# EAGLE design Video_critter_hires_v01 (EAGLE 6.1)
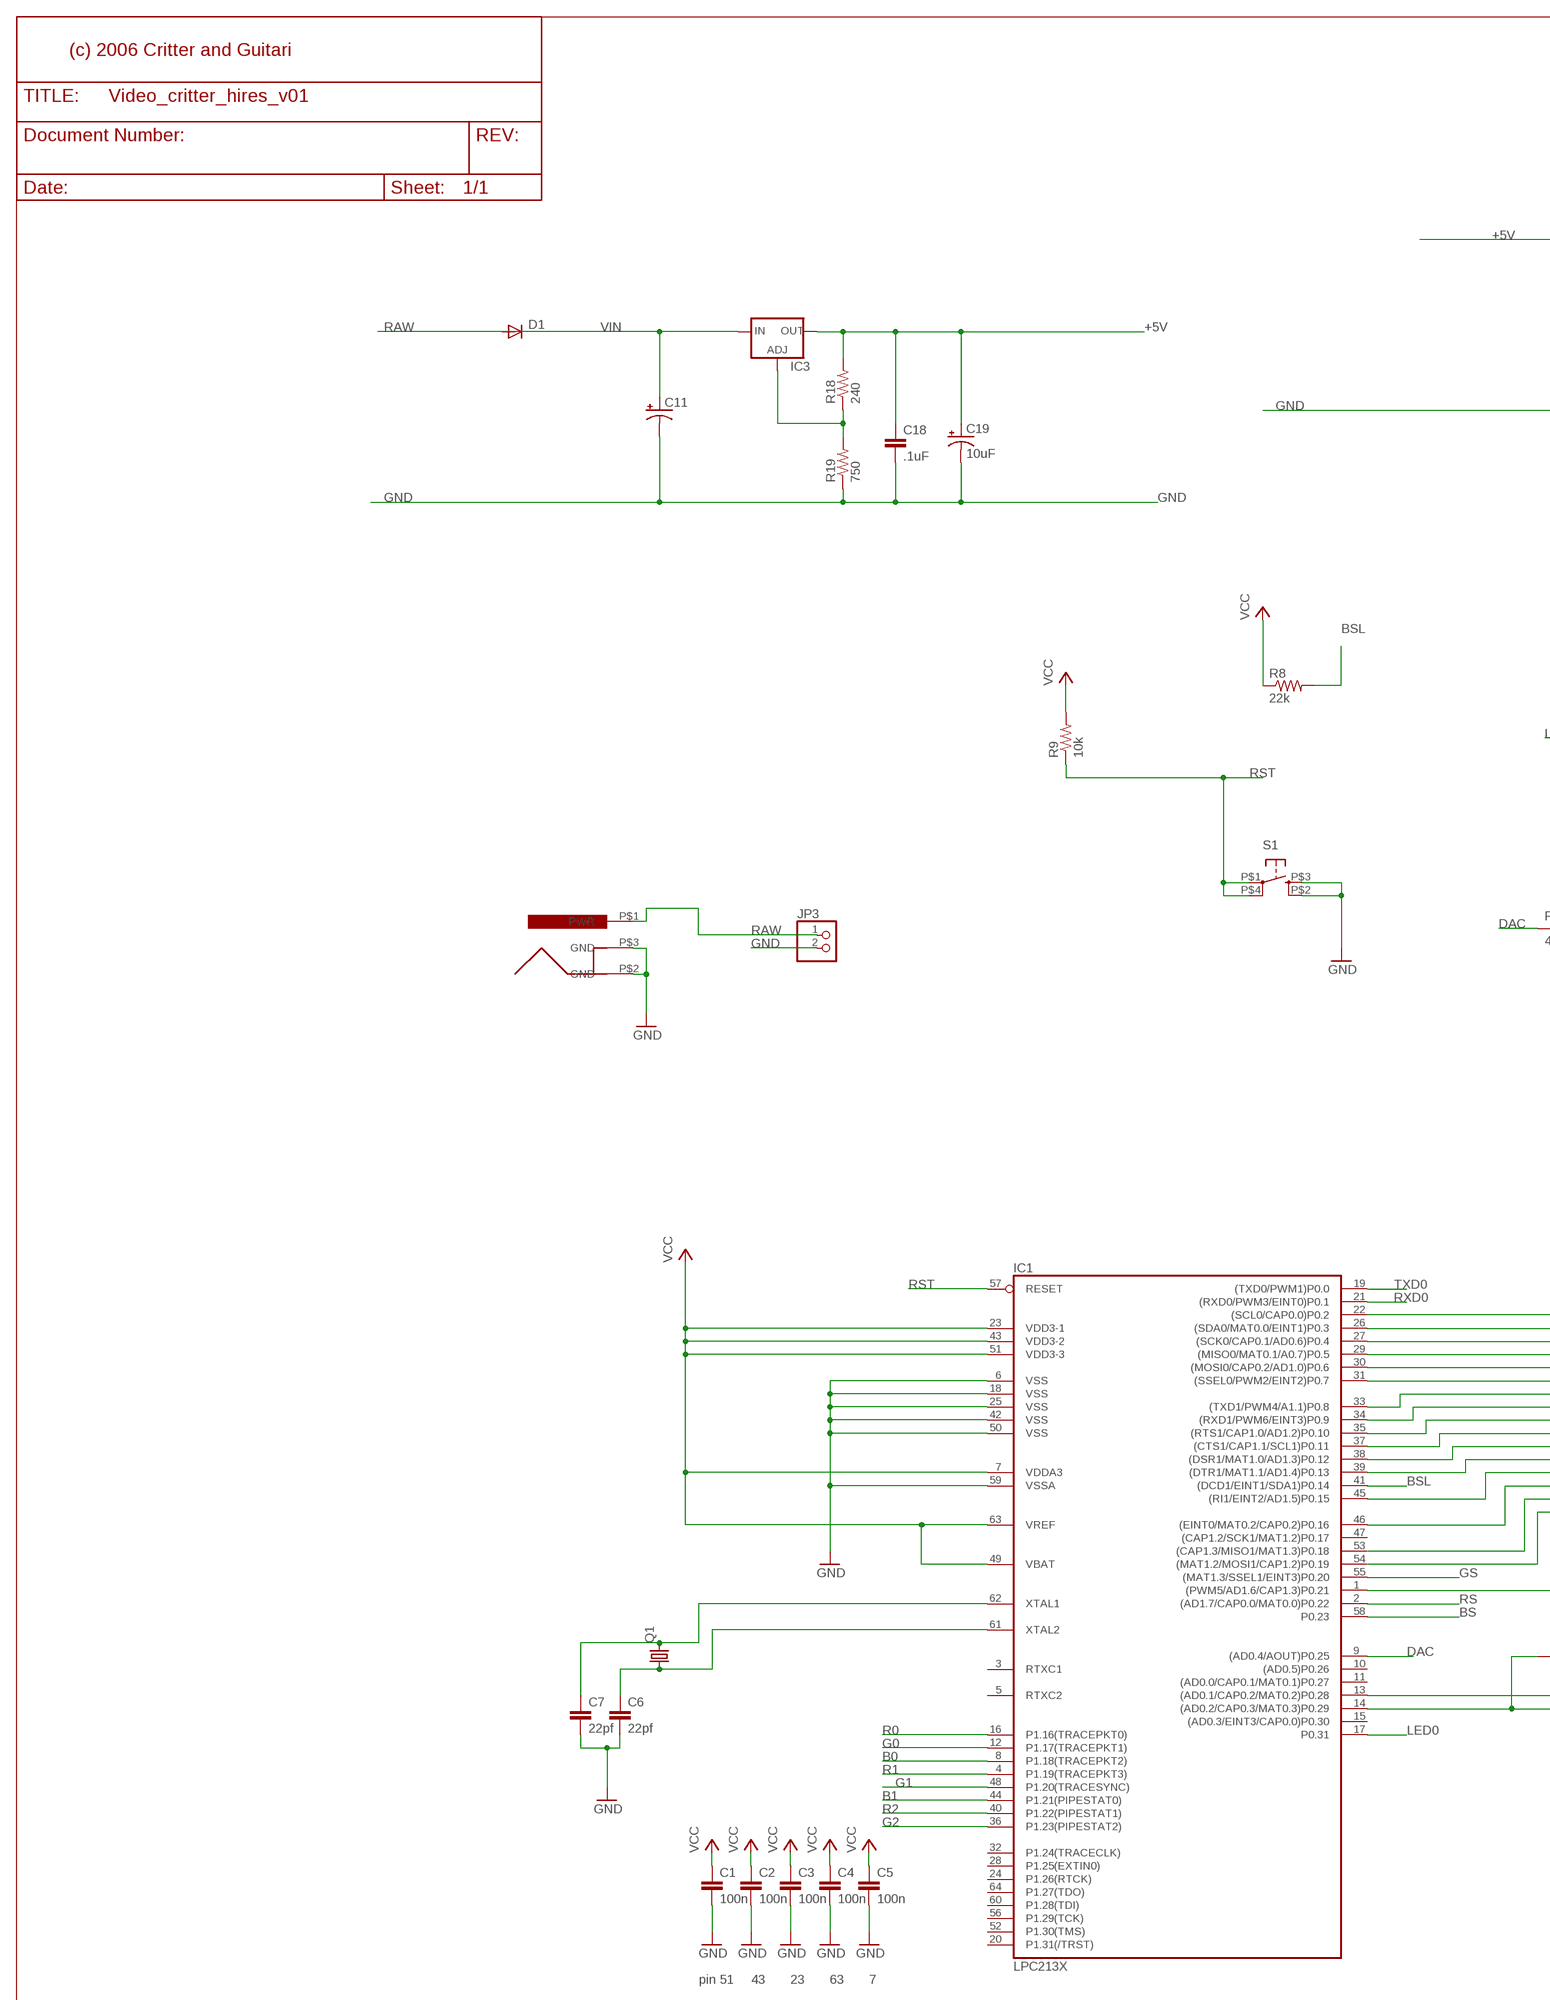
[diagram p0: schematic, sheet 1, part 1 of 2]
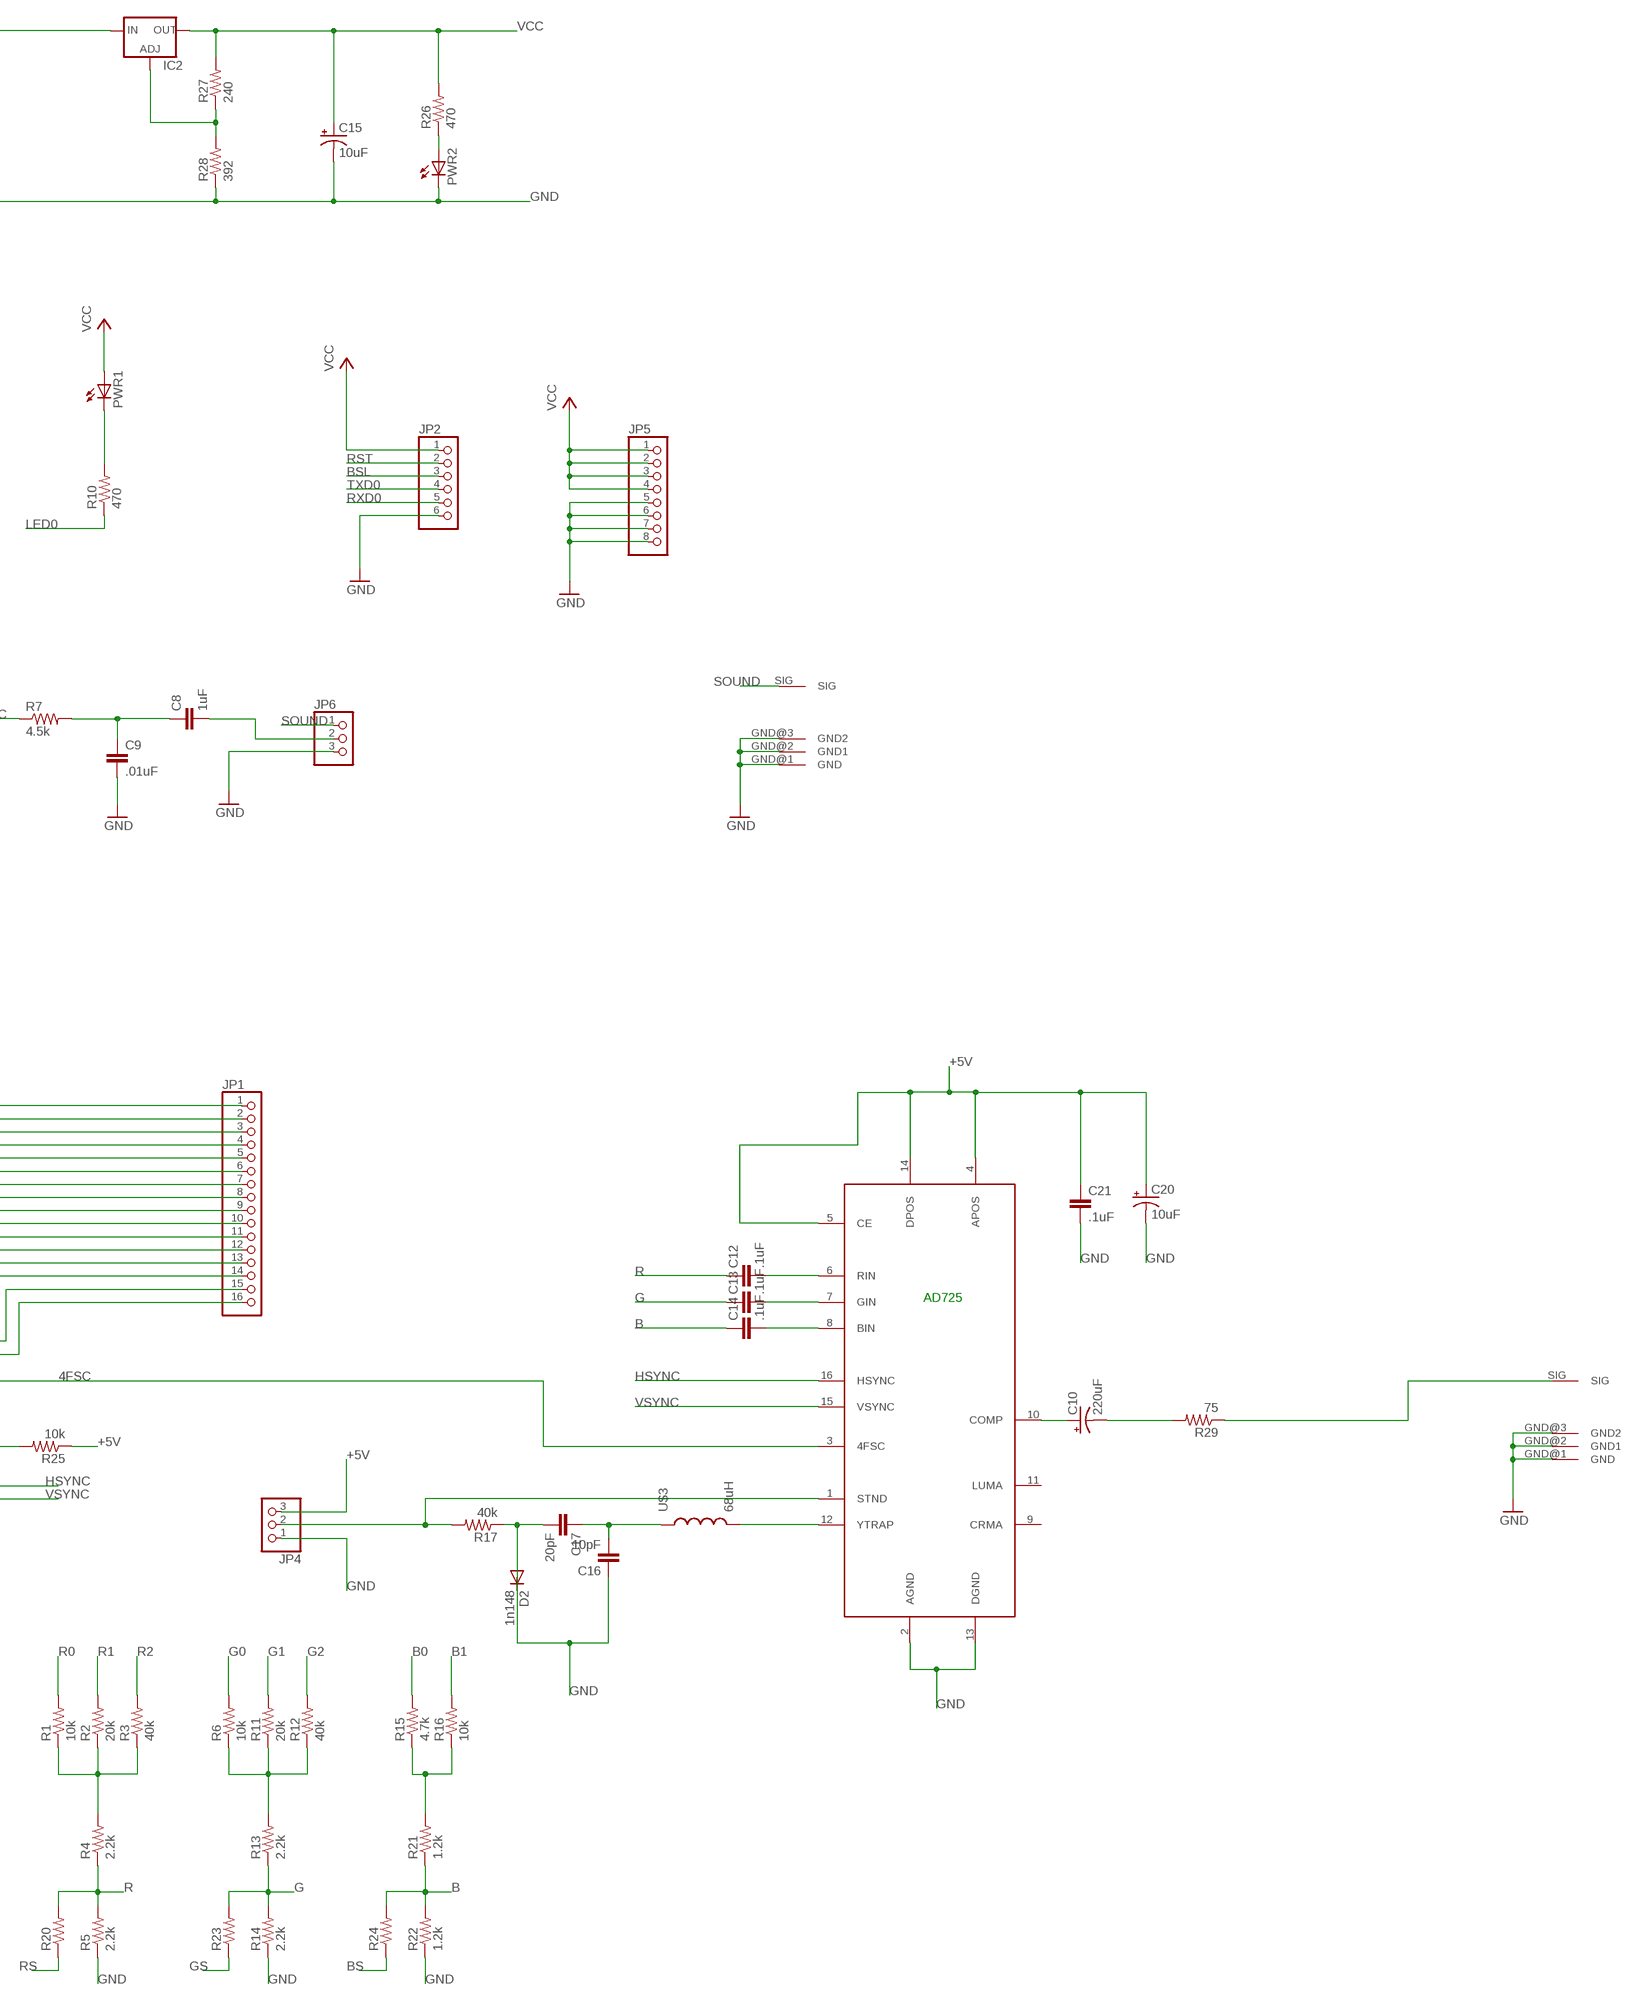
[diagram p1: schematic, sheet 1, part 2 of 2]

## Parts
C1  100n  CAP0603  [C0603]
C2  100n  CAP0603  [C0603]
C3  100n  CAP0603  [C0603]
C4  100n  CAP0603  [C0603]
C5  100n  CAP0603  [C0603]
C6  22pf  CAP0603  [C0603]
C7  22pf  CAP0603  [C0603]
C8  1uF  CAP0603  [C0603]
C9  .01uF  CAP0603  [C0603]
C10  220uF  CPOL-USD  [PANASONIC_D]
C11  CPOL-USE3.5-8  [E3,5-8]
C12  .1uF  CAP0603  [C0603]
C13  .1uF  CAP0603  [C0603]
C14  .1uF  CAP0603  [C0603]
C15  10uF  CAP_POL1206  [CPOL_1206]
C16  10pF  CAP0603  [C0603]
C17  20pF  CAP0603  [C0603]
C18  .1uF  CAP0603  [C0603]
C19  10uF  CAP_POL1206  [CPOL_1206]
C20  10uF  CAP_POL1206  [CPOL_1206]
C21  .1uF  CAP0603  [C0603]
D1  DIODESMB  [SMB]
D2  1n148  DIODE  [SOD323-W]
IC1  LPC213X  [SQFP-S-10X10-64]
IC2  V_REG_FAN1117SOT223  [SOT223]
IC3  V_REG_FAN1117SOT223  [SOT223]
JP1  PINHD-1X16  [1X16]
JP2  PINHD-1X6  [1X06]
JP3  PINHD-1X2  [1X02]
JP4  PINHD-1X3  [1X03]
JP5  PINHD-1X8  [1X08]
JP6  PINHD-1X3  [1X03]
PWR1  LED1206  [CHIPLED_1206]
PWR2  LED1206  [CHIPLED_1206]
Q1  CRYSTALSOCKETED  [HC49U-SOCKETED]
R1  10k  RES0603  [R0603]
R2  20k  RES0603  [R0603]
R3  40k  RES0603  [R0603]
R4  2.2k  RES0603  [R0603]
R5  2.2k  RES0603  [R0603]
R6  10k  RES0603  [R0603]
R7  4.5k  RES0603  [R0603]
R8  22k  RES0603  [R0603]
R9  10k  RES0603  [R0603]
R10  470  RES0603  [R0603]
R11  20k  RES0603  [R0603]
R12  40k  RES0603  [R0603]
R13  2.2k  RES0603  [R0603]
R14  2.2k  RES0603  [R0603]
R15  4.7k  RES0603  [R0603]
R16  10k  RES0603  [R0603]
R17  40k  RES0603  [R0603]
R18  240  RES0603  [R0603]
R19  750  RES0603  [R0603]
R20  RES0603  [R0603]
R21  1.2k  RES0603  [R0603]
R22  1.2k  RES0603  [R0603]
R23  RES0603  [R0603]
R24  RES0603  [R0603]
R25  10k  RES0603  [R0603]
R26  470  RES0603  [R0603]
R27  240  RES0603  [R0603]
R28  392  RES0603  [R0603]
R29  75  RES0603  [R0603]
S1  TAC_SWITCH  [TACTILE_SWITCH_SMD]
U$1  POWER_JACK  POWER_JACKTHRU-HOLE  [POWER_JACK]
U$2  AD725  [SO16L]
U$3  68uH  INDUCTORSMALL  [INDUCTOR_SMALL]
U$5  PHONO_PLUG  [PHONO_PCB]
U$7  PHONO_PLUG  [PHONO_PCB]

## Nets
4FSC: IC1.1((PWM5/AD1.6/CAP1.3)P0.21) U$2.3(4FSC)
+5V: C18.1 C19.A(+) C20.A(+) C21.1 IC2.3(IN) IC3.2(OUT) JP4.3 R18.2 R25.1 U$2.4(APOS) U$2.5(CE) U$2.14(DPOS)
B: C14.1 R21.1 R22.2 R24.2
B0: IC1.8(P1.18(TRACEPKT2)) R15.2
B1: IC1.44(P1.21(PIPESTAT0)) R16.2
BS: IC1.58(P0.23) R24.1
BSL: IC1.41((DCD1/EINT1/SDA1)P0.14) JP2.3 R8.2
BURST: IC1.31((SSEL0/PWM2/EINT2)P0.7) JP1.6
DAC: IC1.9((AD0.4/AOUT)P0.25) R7.1
G: C13.1 R13.1 R14.2 R23.2
G0: IC1.12(P1.17(TRACEPKT1)) R6.2
G1: IC1.48(P1.20(TRACESYNC)) R11.2
G2: IC1.36(P1.23(PIPESTAT2)) R12.2
GND [power]: C1.2 C2.2 C3.2 C4.2 C5.2 C6.2 C7.2 C9.2 C11.- C15.C(-) C16.1 C18.2 C19.C(-) C20.C(-) C21.2 D2.A IC1.6(VSS) IC1.18(VSS) IC1.25(VSS) IC1.42(VSS) IC1.50(VSS) IC1.59(VSSA) JP2.6 JP3.2 JP4.1 JP5.5 JP5.6 JP5.7 JP5.8 JP6.3 PWR2.C R5.1 R14.1 R19.1 R22.1 R28.1 S1.P$2(S1) S1.P$3(S) U$1.P$2(GND) U$1.P$3(GND) U$2.2(AGND) U$2.13(DGND) U$5.GND@1(GND) U$5.GND@2(GND1) U$5.GND@3(GND2) U$7.GND@1(GND) U$7.GND@2(GND1) U$7.GND@3(GND2)
GS: IC1.55((MAT1.3/SSEL1/EINT3)P0.20) R23.1
HSYNC: IC1.13((AD0.1/CAP0.2/MAT0.2)P0.28) U$2.16(HSYNC)
LED0: IC1.17(P0.31) R10.1
N$1: C8.1 C9.1 R7.2
N$2: C7.1 IC1.62(XTAL1) Q1.2
N$3: C6.1 IC1.61(XTAL2) Q1.1
N$4: PWR1.C R10.2
N$5: C10.+ U$2.10(COMP)
N$6: IC1.22((SCL0/CAP0.0)P0.2) JP1.1
N$7: C8.2 JP6.2
N$8: C12.2 U$2.6(RIN)
N$9: IC1.26((SDA0/MAT0.0/EINT1)P0.3) JP1.2
N$10: IC1.27((SCK0/CAP0.1/AD0.6)P0.4) JP1.3
N$11: IC3.1(ADJ) R18.1 R19.2
N$12: IC1.29((MISO0/MAT0.1/A0.7)P0.5) JP1.4
N$13: IC1.30((MOSI0/CAP0.2/AD1.0)P0.6) JP1.5
N$14: C13.2 U$2.7(GIN)
N$15: IC1.33((TXD1/PWM4/A1.1)P0.8) JP1.7
N$16: IC1.34((RXD1/PWM6/EINT3)P0.9) JP1.8
N$17: IC1.35((RTS1/CAP1.0/AD1.2)P0.10) JP1.9
N$18: IC1.37((CTS1/CAP1.1/SCL1)P0.11) JP1.10
N$19: IC1.38((DSR1/MAT1.0/AD1.3)P0.12) JP1.11
N$20: IC1.39((DTR1/MAT1.1/AD1.4)P0.13) JP1.12
N$21: IC1.45((RI1/EINT2/AD1.5)P0.15) JP1.13
N$22: IC1.46((EINT0/MAT0.2/CAP0.2)P0.16) JP1.14
N$23: IC1.53((CAP1.3/MISO1/MAT1.3)P0.18) JP1.15
N$24: U$2.12(YTRAP) U$3.P$2
N$25: IC1.54((MAT1.2/MOSI1/CAP1.2)P0.19) JP1.16
N$26: C14.2 U$2.8(BIN)
N$27: R1.1 R2.1 R3.1 R4.2
N$28: R29.1 U$7.SIG
N$29: R6.1 R11.1 R12.1 R13.2
N$30: PWR2.A R26.1
N$31: R15.1 R16.1 R21.2
N$32: IC2.1(ADJ) R27.1 R28.2
N$33: C16.2 C17.1 U$3.P$1
N$34: C17.2 D2.C R17.1
N$35: JP4.2 R17.2 U$2.1(STND)
N$36: C10.- R29.2
R: C12.1 R4.1 R5.2 R20.2
R0: IC1.16(P1.16(TRACEPKT0)) R1.2
R1: IC1.4(P1.19(TRACEPKT3)) R2.2
R2: IC1.40(P1.22(PIPESTAT1)) R3.2
RAW: D1.1(C) JP3.1 U$1.P$1(PWR)
RS: IC1.2((AD1.7/CAP0.0/MAT0.0)P0.22) R20.1
RST: IC1.57(RESET) JP2.2 R9.1 S1.P$1(P) S1.P$4(P1)
RXD0: IC1.21((RXD0/PWM3/EINT0)P0.1) JP2.5
SOUND: JP6.1 U$5.SIG
TXD0: IC1.19((TXD0/PWM1)P0.0) JP2.4
VCC [power]: C1.1 C2.1 C3.1 C4.1 C5.1 C15.A(+) IC1.7(VDDA3) IC1.23(VDD3-1) IC1.43(VDD3-2) IC1.49(VBAT) IC1.51(VDD3-3) IC1.63(VREF) IC2.2(OUT) JP2.1 JP5.1 JP5.2 JP5.3 JP5.4 PWR1.A R8.1 R9.2 R26.2 R27.2
VIN [power]: C11.+ D1.2(A) IC3.3(IN)
VSYNC: IC1.14((AD0.2/CAP0.3/MAT0.3)P0.29) R25.2 U$2.15(VSYNC)
Unconnected: IC1.3(RTXC1) IC1.5(RTXC2) IC1.10((AD0.5)P0.26) IC1.11((AD0.0/CAP0.1/MAT0.1)P0.27) IC1.15((AD0.3/EINT3/CAP0.0)P0.30) IC1.20(P1.31(/TRST)) IC1.24(P1.26(RTCK)) IC1.28(P1.25(EXTIN0)) IC1.32(P1.24(TRACECLK)) IC1.47((CAP1.2/SCK1/MAT1.2)P0.17) IC1.52(P1.30(TMS)) IC1.56(P1.29(TCK)) IC1.60(P1.28(TDI)) IC1.64(P1.27(TDO)) U$2.9(CRMA) U$2.11(LUMA)

## Notes on the sheet
- (c) 2006 Critter and Guitari
- AD725
- pin 51 | 43 | 23 | 63 | 7

## Library data of the parts
C1-C9 C12-C14 C16-C18 C21 = SparkFun:CAP: CAPACITOR
C10 C11 = rcl:CPOL-US: POLARIZED CAPACITOR, American symbol
C15 C19 C20 = SparkFun:CAP_POL
D1 D2 = SparkFun:DIODE
IC1 = SparkFun:LPC213X
IC2 IC3 = SparkFun:V_REG_FAN1117: VOLTAGE REGULATOR
JP1 = pinhead:PINHD-1X16: PIN HEADER
JP2 = pinhead:PINHD-1X6: PIN HEADER
JP3 = pinhead:PINHD-1X2: PIN HEADER
JP4 JP6 = pinhead:PINHD-1X3: PIN HEADER
JP5 = pinhead:PINHD-1X8: PIN HEADER
PWR1 PWR2 = SparkFun:LED
Q1 = SparkFun:CRYSTAL
R1-R29 = SparkFun:RES: RESISTOR
S1 = SparkFun:TAC_SWITCH: OMRON SWITCH
U$1 = SparkFun:POWER_JACK
U$2 = SparkFun:AD725
U$3 = SparkFun:INDUCTOR
U$5 U$7 = sfe_owen:PHONO_PLUG

## Net classes
0 default: width 0.254 mm
1 power: width 0.254 mm

## Board
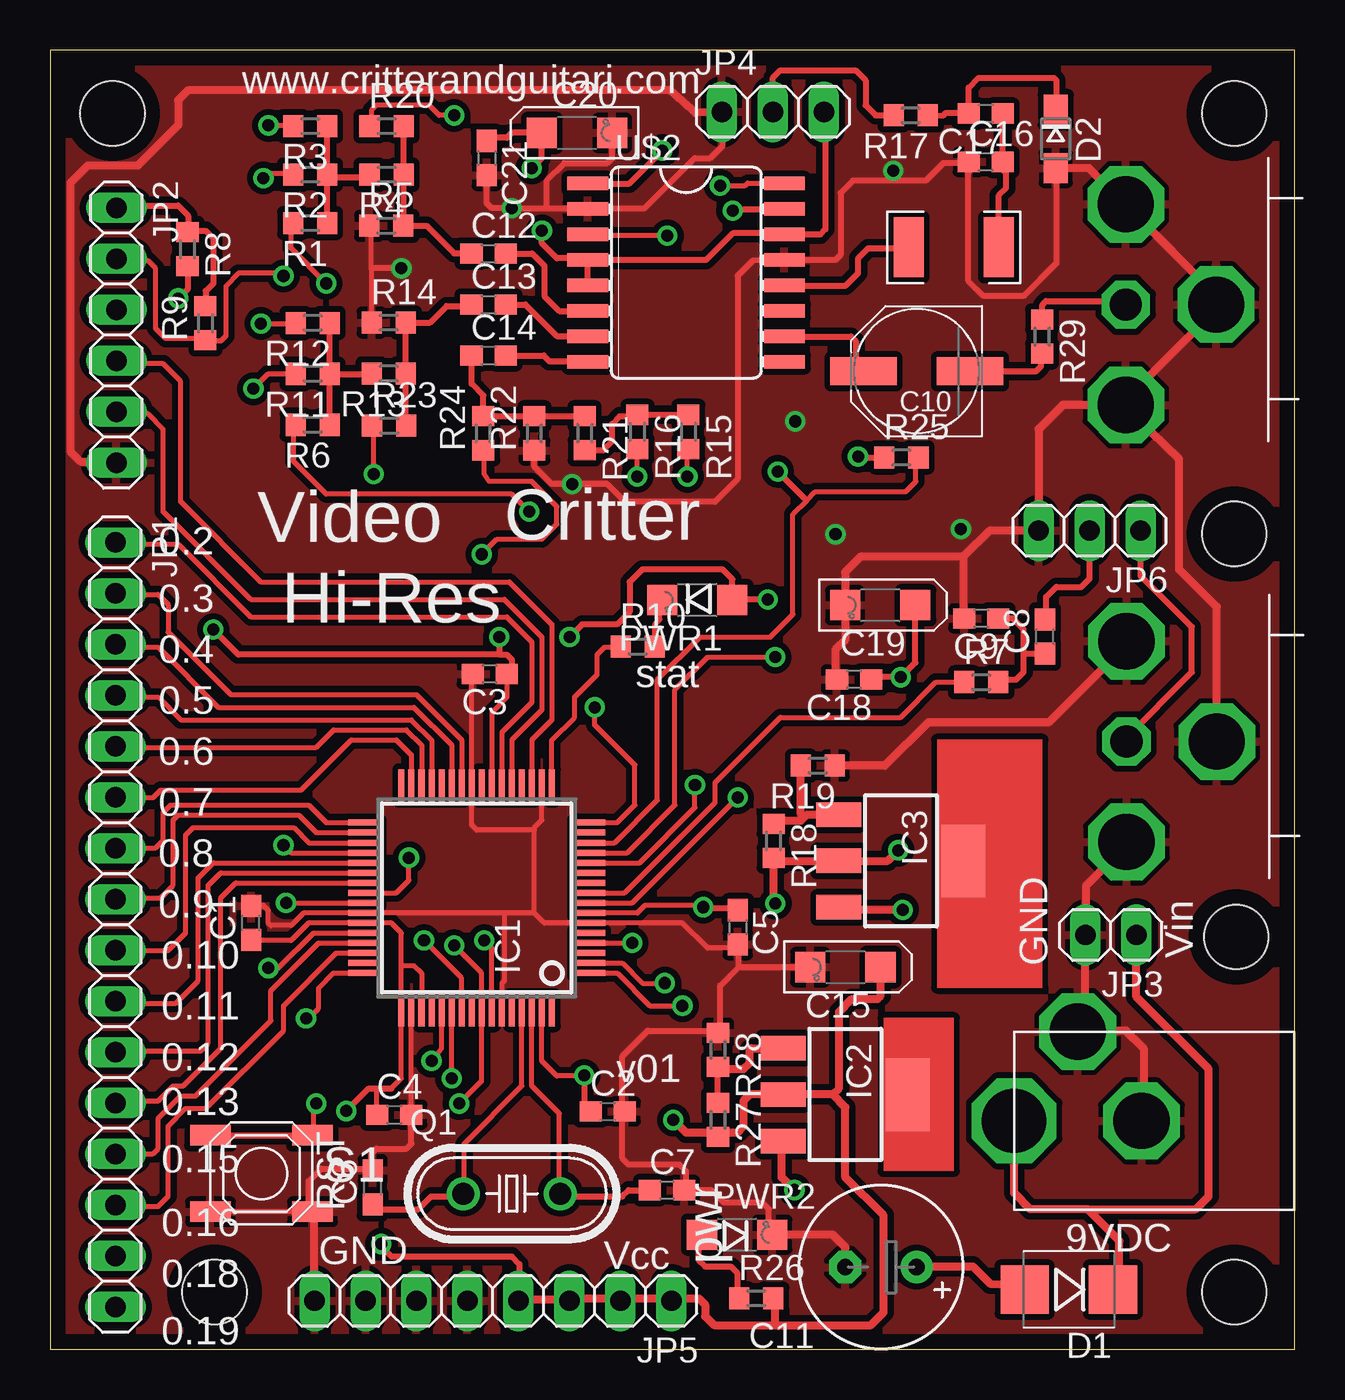
[diagram p2: board, top side]
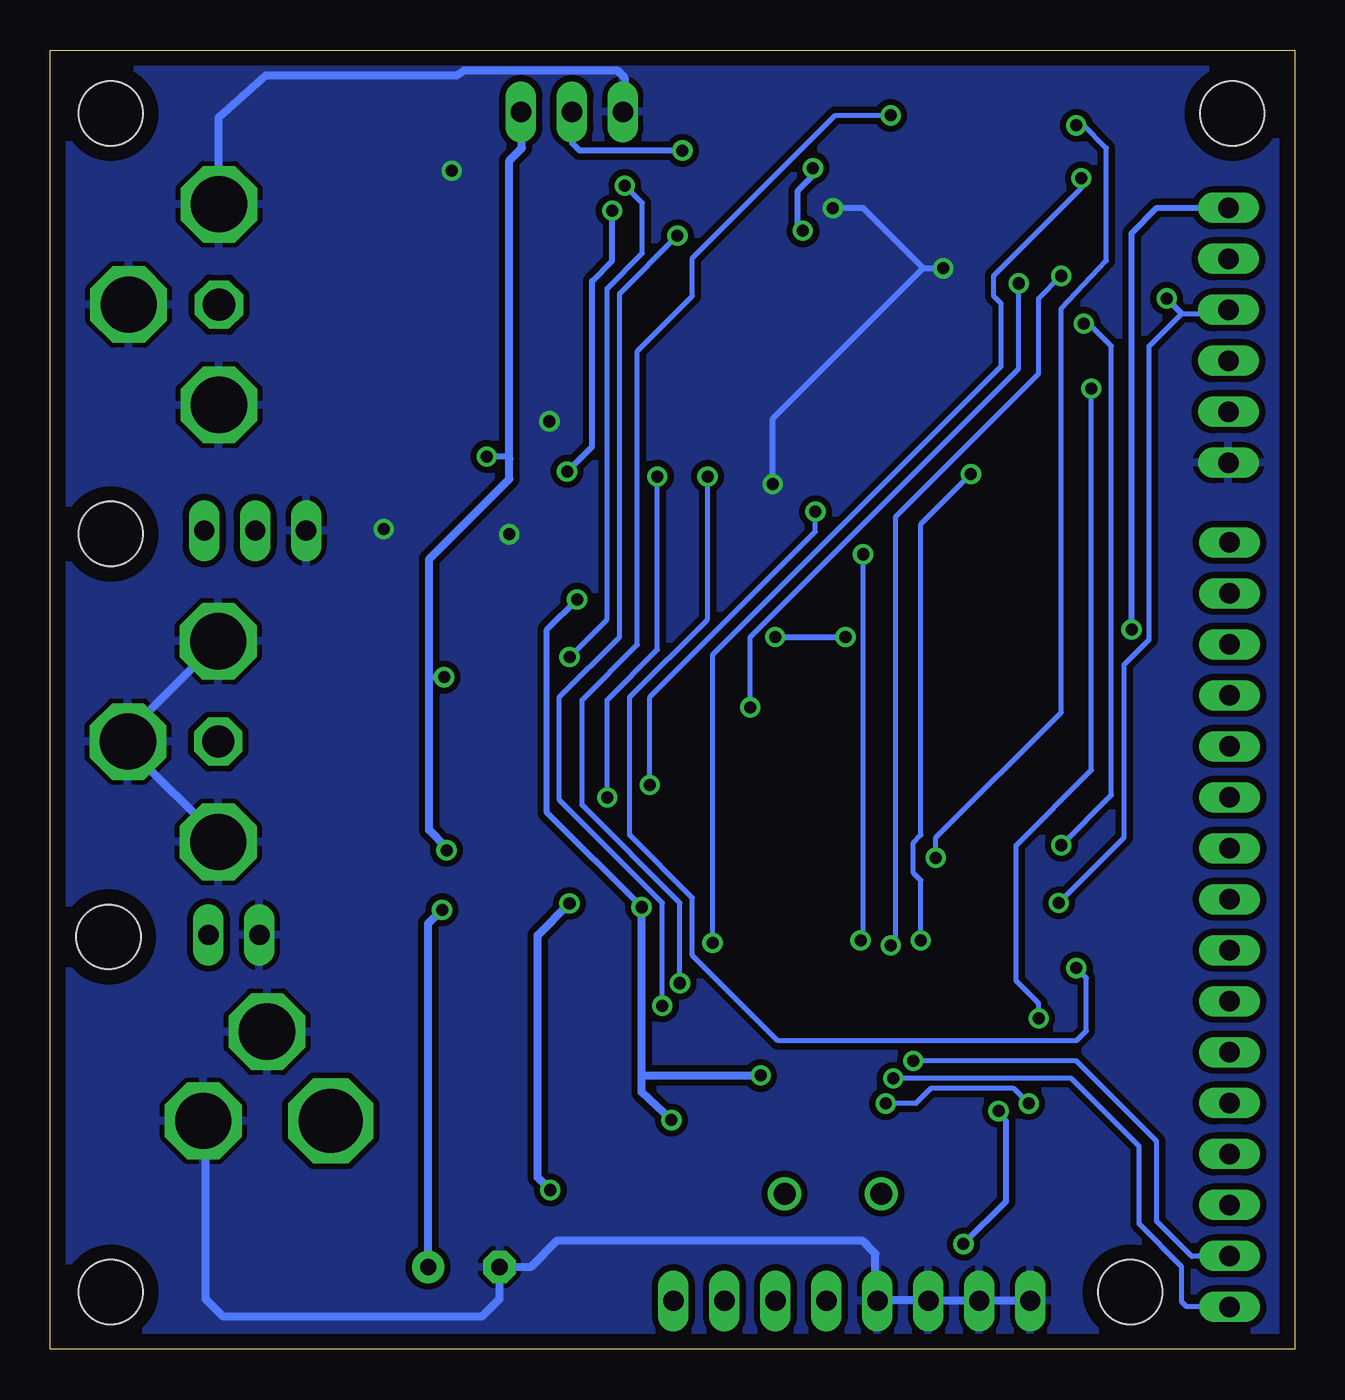
[diagram p3: board, bottom side, seen from below]

Size 62 x 64.75 mm. Coordinates in mm from the lower left corner, seen from the top.
Outline: 0,0 62,0 62,64.75 0,64.75 0,0
Copper layers (1*16): Top 0.035mm / dielectric 1.5mm / Bottom 0.035mm
Design rules: minimum track width 10mil, minimum drill 20mil, track to track 8mil, track to pad 8mil, pad to pad 8mil, via to via 8mil, smd to smd 8mil, copper to edge 30mil, drill to drill 8mil, minimum pad ring 10mil, minimum via ring 8mil, stop-mask expansion 4mil, vias tented up to drill 0mil, thermal gap 10mil
Holes 3.2 mm at 58.99,2.86 58.99,40.64 59.09,20.55 58.99,61.59 3.11,61.59 8.19,2.86

### Footprints (pad centres in the part's own frame; a part is rotated, then mirrored left to right if it is on the bottom)
C0603 = smd 1.1 x 1: 1 -0.85,0; 2 0.85,0
PANASONIC_D = smd 3.302 x 1.397: + 2.654,0; - -2.654,0
E3,5-8 = drill 0.813 pad 1.6: + -1.778,0 | drill 0.813 pad 1.6 octagon: - 1.778,0
CPOL_1206 = smd 1.5 x 1.5: A 0,-1.75; C 0,1.75
SMB = smd 2.4 x 2.4: 1 -2.2,0; 2 2.2,0
SOD323-W = smd 1.5 x 1.2: A 1.45,0; C -1.45,0
SQFP-S-10X10-64 = smd 0.3 x 1.6: 1 -3.75,-5.6; 2 -3.25,-5.6; 3 -2.75,-5.6; 4 -2.25,-5.6; 5 -1.75,-5.6; 6 -1.25,-5.6; 7 -0.75,-5.6; 8 -0.25,-5.6; 9 0.25,-5.6; 10 0.75,-5.6; 11 1.25,-5.6; 12 1.75,-5.6; 13 2.25,-5.6; 14 2.75,-5.6; 15 3.25,-5.6; 16 3.75,-5.6; 33 3.75,5.6; 34 3.25,5.6; 35 2.75,5.6; 36 2.25,5.6; 37 1.75,5.6; 38 1.25,5.6; 39 0.75,5.6; 40 0.25,5.6; 41 -0.25,5.6; 42 -0.75,5.6; 43 -1.25,5.6; 44 -1.75,5.6; 45 -2.25,5.6; 46 -2.75,5.6; 47 -3.25,5.6; 48 -3.75,5.6 | smd 1.6 x 0.3: 17 5.6,-3.75; 18 5.6,-3.25; 19 5.6,-2.75; 20 5.6,-2.25; 21 5.6,-1.75; 22 5.6,-1.25; 23 5.6,-0.75; 24 5.6,-0.25; 25 5.6,0.25; 26 5.6,0.75; 27 5.6,1.25; 28 5.6,1.75; 29 5.6,2.25; 30 5.6,2.75; 31 5.6,3.25; 32 5.6,3.75; 49 -5.6,3.75; 50 -5.6,3.25; 51 -5.6,2.75; 52 -5.6,2.25; 53 -5.6,1.75; 54 -5.6,1.25; 55 -5.6,0.75; 56 -5.6,0.25; 57 -5.6,-0.25; 58 -5.6,-0.75; 59 -5.6,-1.25; 60 -5.6,-1.75; 61 -5.6,-2.25; 62 -5.6,-2.75; 63 -5.6,-3.25; 64 -5.6,-3.75
SOT223 = smd 1.219 x 2.235: 1 -2.311,-3.099; 2 0,-3.099; 3 2.311,-3.099 | smd 3.6 x 2.2: 4 0,3.099
1X16 = drill 1.016 long: 1 -19.05,0; 2 -16.51,0; 3 -13.97,0; 4 -11.43,0; 5 -8.89,0; 6 -6.35,0; 7 -3.81,0; 8 -1.27,0; 9 1.27,0; 10 3.81,0; 11 6.35,0; 12 8.89,0; 13 11.43,0; 14 13.97,0; 15 16.51,0; 16 19.05,0
1X06 = drill 1.016 long: 1 -6.35,0; 2 -3.81,0; 3 -1.27,0; 4 1.27,0; 5 3.81,0; 6 6.35,0
1X02 = drill 1.016 long: 1 -1.27,0; 2 1.27,0
1X03 = drill 1.016 long: 1 -2.54,0; 2 0,0; 3 2.54,0
1X08 = drill 1.016 long: 1 -8.89,0; 2 -6.35,0; 3 -3.81,0; 4 -1.27,0; 5 1.27,0; 6 3.81,0; 7 6.35,0; 8 8.89,0
CHIPLED_1206 = smd 1.5 x 1.5: A 0,-1.75; C 0,1.75
HC49U-SOCKETED = drill 1.1: 1 -2.413,0; 2 2.413,0
R0603 = smd 1 x 1.1: 1 -0.85,0; 2 0.85,0
TACTILE_SWITCH_SMD = smd 2.032 x 1.016: P$1 -2.54,1.905; P$2 -2.54,-1.905; P$3 2.54,-1.905; P$4 2.54,1.905
POWER_JACK = drill 3.2 octagon: P$1 0,4.445 | drill 2.8 octagon: P$2 3.175,8.89; P$3 6.35,4.445
SO16L = smd 0.66 x 2.032: 1 -4.445,-4.902; 2 -3.175,-4.902; 3 -1.905,-4.902; 4 -0.635,-4.902; 5 0.635,-4.902; 6 1.905,-4.902; 7 3.175,-4.902; 8 4.445,-4.902; 9 4.445,4.902; 10 3.175,4.902; 11 1.905,4.902; 12 0.635,4.902; 13 -0.635,4.902; 14 -1.905,4.902; 15 -3.175,4.902; 16 -4.445,4.902
INDUCTOR_SMALL = smd 1.5 x 3: P$1 -2.25,0; P$2 2.25,0
PHONO_PCB = drill 2.8 octagon: GND@1 0,5; GND@2 0,-5; GND@3 4.5,0 | drill 1.6 octagon: SIG 0,0

### Placement (x,y rotation side)
C1  10.01,21.25 90 top
C2  27.78,11.85 0 top
C3  21.89,33.66 180 top
C4  17.14,11.69 0 top
C5  34.26,21.04 270 top
C6  16.07,8.08 90 top
C7  30.73,7.94 0 top
C8  49.57,35.53 90 top
C9  46.39,36.42 180 top
C10  43.17,48.75 180 top
C11  41.39,4.1 180 top
C12  21.84,54.61 0 top
C13  21.84,52.07 0 top
C14  21.84,49.53 0 top
C15  39.62,19.05 90 top
C16  46.6,59.18 0 top
C17  46.6,61.59 180 top
C18  40.05,33.38 180 top
C19  41.35,37.09 90 top
C20  26.25,60.62 270 top
C21  21.75,59.38 270 top
D1  50.75,2.98 180 top
D2  50.1,60.33 270 top
IC1  21.25,22.5 90 top
IC2  39.62,12.7 270 top
IC3  42.39,24.34 270 top
JP1  3.25,21.16 270 top
JP2  3.29,50.54 270 top
JP3  52.84,20.65 180 top
JP4  36.01,61.67 0 top
JP5  22.06,2.42 180 top
JP6  51.79,40.8 180 top
PWR1  32.24,37.35 90 top
PWR2  34.22,5.71 270 top
Q1  23,7.76 0 top
R1  12.95,56.13 180 top
R2  12.95,58.55 180 top
R3  12.95,60.96 180 top
R4  16.76,58.55 180 top
R5  16.74,55.99 0 top
R6  13.07,46.08 180 top
R7  46.39,33.25 0 top
R8  6.84,54.83 270 top
R9  7.74,51.14 90 top
R10  29.27,35.02 0 top
R11  13.07,48.62 180 top
R12  13.07,51.16 180 top
R13  16.86,48.63 180 top
R14  16.86,51.17 0 top
R15  31.8,45.73 270 top
R16  29.25,45.73 270 top
R17  42.88,61.5 180 top
R18  36.04,25.34 270 top
R19  38.25,29.09 180 top
R20  16.76,60.96 0 top
R21  26.63,45.66 270 top
R22  24.12,45.66 90 top
R23  16.89,46.03 0 top
R24  21.58,45.66 90 top
R25  42.41,44.45 0 top
R26  35.17,2.54 0 top
R27  33.27,11.43 270 top
R28  33.27,14.92 270 top
R29  49.42,50.48 270 top
S1  10.53,8.77 0 top
U$1  48.02,6.94 0 top
U$2  31.68,53.66 270 top
U$3  45.02,54.93 180 top
U$5  53.62,30.29 0 top
U$7  53.59,52.07 0 top

### Tracks (layer width: path | path; a pad name or v marks a point on that pad's centre or on a via)
4FSC  (via drill 0.6)
  Top 0.254: IC1.1 28.25,18.75 29.88,17.12 v31.5,17.12 | U$2.3 26.78,55.53 26.75,55.5 v30.75,55.5
  Bottom 0.254: v31.5,17.12 31.5,22.25 36.62,27.38 36.62,32.5 33.62,35.5 33.62,52.62 v30.75,55.5
+5V  (via drill 0.6)
  Top 0.305: R25.1 40.3,44.45 v40.25,44.5 | C19.A 43.1,34.23 v42.38,33.5 41,33.5 40.9,33.4 C18.1 | U$2.5 26.76,53 26.75,53 26.75,54.26 U$2.4 | JP4.3 38.58,62.05 38.62,62 38.62,55.82 38.37,55.56 U$2.14 36.56,55.56 36.5,55.5 36.38,55.62 34,55.62 32.67,54.29 U$2.4 | C21.1 21.75,60.38 22.75,60.38 23,60.62 C20.A 24.5,59.38 v24,58.88 | v24.5,55.75 24.5,55.12 25.25,54.38 26.62,54.38 26.78,54.22 | 26.78,54.22 26.88,54.12 | U$2.4 26.78,54.22
  Top 0.406: v36.13,22.23 36.04,22.31 R18.2 35.86,24.5 35.81,24.45 35.91,24.34 IC3.2 41.72,24.34 v42.25,24.88 | v37.08,7.94 36.45,8.57 36.45,10.16 36.52,10.24 IC2.3
  Bottom 0.305: v40.25,44.5 39.25,44.5 39.12,44.38 | v42.38,33.5 43,33.5 43.12,33.62 | v24,58.88 24,58.5 24.75,57.75 24.75,56 v24.5,55.75
  Bottom 0.406: v36.13,22.23 37.72,20.64 37.72,8.57 v37.08,7.94 | v42.25,24.88 42.25,25 43.12,25.88 43.12,33.62 43.12,39.38 39.12,43.38 39.12,44.38 39.12,59.25 38.5,59.88 38.5,61.88 38.62,62 38.58,62.05 JP4.3
B
  Top 0.305: R21.1 R22.2 R24.2 21.58,47.55 21,48.12 21,49.5 20.99,49.51 C14.1
B0  (via drill 0.6)
  Top 0.254: IC1.8 29,22.25 v34.25,27.5 | R15.2 31.75,44.88 v31.75,43.5
  Bottom 0.254: v34.25,27.5 34.25,32.38 31.75,34.88 v31.75,43.5
B1  (via drill 0.6)
  Top 0.254: IC1.44 13.12,20.75 11.38,19 v10.88,19 | R16.2 29.25,45 | R16.2 | v29.25,43.5 R16.2
  Bottom 0.254: v10.88,19 10.38,18.5 10.38,15.88 10.88,15.38 25.75,15.38 30,19.62 30,22.5 33.12,25.62 33.12,32.5 29.25,36.38 v29.25,43.5
BS  (via drill 0.6)
  Top 0.254: IC1.58 22,20 v21.62,20.38 | v21.5,39.62 22.25,40.38 24.5,40.38 25.25,41.12 25.25,42 24,43.25 21.88,43.25 21.62,43.62 21.62,44.76 R24.1
  Bottom 0.254: v21.62,20.38 21.5,20.5 v21.5,39.62
BSL  (via drill 0.6)
  Top 0.254: v11.75,22.25 IC1.41
  Top 0.305: R8.2 6.74,53.88 6.88,53.75 6.88,52.88 v6.38,52.38
  Bottom 0.254: v11.75,22.25 8.5,25.5 8.5,34.12 7.25,35.38 7.25,50 5.62,51.62 3.12,51.62 3.12,51.64 JP2.3
  Bottom 0.305: 5.62,51.62 v6.38,52.38
BURST
  Top 0.254: IC1.31 18,29.62 17.25,30.38 15,30.38 12.5,27.88 5.5,27.88 5.12,27.5 3.12,27.5 3.11,27.51 | 3.11,27.51 3,27.62 | JP1.6 3.11,27.51
DAC
  Top 0.254: IC1.9 28.62,22.75 33.12,27.25 33.12,28.25 36.38,31.5 42.38,31.5 44.12,33.25 45.62,33.25 | 45.62,33.25 | 45.62,33.25 R7.1
G
  Top 0.305: R14.2 R13.1 17.71,46.03 17.73,46.02 | R14.2 17.71,51.34 17.75,51.38 | 17.73,46.02 17.88,45.88 | R23.2 17.73,46.02 | R14.2 18.93,51.17 19.75,52 21.12,52 21.05,52.07 C13.1
G0  (via drill 0.6)
  Top 0.254: IC1.12 29.38,24.25 32.12,27 v32.12,28.12 | v23.88,41.75 23,42.62 13.75,42.62 12.12,44.25 12.12,46 12.15,46 R6.2
  Bottom 0.254: v32.12,28.12 32.12,32.5 23.88,40.75 v23.88,41.75
G1  (via drill 0.6)
  Top 0.254: IC1.48 14.12,18.75 13.38,18 13.38,17 12.88,16.5 v12.75,16.5 | 12.23,48.62 12.25,48.62 | 12.23,48.62 R11.2 | v10.12,47.88 10.88,48.62 12.23,48.62
  Bottom 0.254: v12.75,16.5 12.75,17.25 13.88,18.38 13.88,25.12 10.12,28.88 v10.12,47.88
G2  (via drill 0.6)
  Top 0.254: IC1.36 12,24.75 v11.62,25.12 | R12.2 12.25,51.13 12.25,51.12 v10.5,51.12
  Bottom 0.254: v11.62,25.12 9.12,27.62 9.12,50 10.25,51.12 v10.5,51.12
GND  (via drill 0.6)
  Top 0.254: 27,21.25 31.5,21.25 32.75,20 34.25,20 C5.2 | C4.2 18,11.62 IC1.50 | 22.62,21.75 IC1.42 12.62,21.75 12,21.12 11,21.12 10.88,21.25 10.88,21.87 10.62,22.12 10.38,22.12 C1.2 | 24.12,21.75 24.62,21.25 27,21.25 | 27,21.25 IC1.6 | 24.12,21.75 22.62,21.75 | 22.62,21.75 22.62,18.38 22.5,18.25 IC1.59 22.5,16.75 | 24.12,21.75 24.12,25.88 | 24.12,25.88 24.12,26 24.5,26.38 IC1.18 24.5,28.12 | 24.12,25.88 21.25,25.88 21,26.12 IC1.25 21,33.62 C3.2 | R14.1 16,51.12 | R14.1 | R5.1 16,55.88 16,53.88 R14.1 | S1.P$2 9,6.88 12.12,6.88 S1.P$3 | 45.75,58.62 C16.1
  Top 0.305: C5.2 34.32,20.12 34.32,19.05 | 34.32,19.05 33.38,18.12 33.38,16 33.27,15.88 | 33.27,15.56 R28.1 33.27,15.88 | 34.32,19.05 C15.C | 33.27,15.88 29.78,15.88 28.51,14.61 28.51,11.75 | 28.51,11.75 C2.2 | 31.68,7.94 32.95,7.94 33.59,7.3 35.49,7.3 35.81,6.99 35.81,5.71 PWR2.C | 28.51,11.75 28.51,9.53 28.82,9.21 31.36,9.21 31.68,8.89 31.68,7.94 | 31.68,7.94 C7.2 | S1.P$3 12.88,7 12.88,8.38 13.5,9 15.75,9 C6.2 16,9 16,9.75 16.25,10 17.75,10 18,10.25 C4.2 | 24.75,56.88 26.74,56.88 U$2.2 26.82,56.88 | 24.75,56.88 v23,56.88 22,56.88 21.75,57.12 C21.2 | v17.5,53.88 16,53.88 | 26.82,56.88 29.62,56.88 32.12,59.38 32.88,59.38 33.5,60 33.5,62.02 JP4.1 | C16.1 45.68,59.18 45.62,59.12 44.5,59.12 44.38,59 43.62,58.25 43.5,58.25 40,58.25 39.38,57.62 39.38,54.55 39.12,54.29 U$2.13 35,54.25 34.25,53.5 34.25,43.38 33.12,42.25 28.62,42.25 27.75,43.12 v26,43.12 25,43.12 24.12,44.01 R22.1 | 24.75,56.88 26.82,56.88 | 24.75,56.88 24.75,58.25 25.62,59.12 27.75,59.12 28,59.38 28,60.5 27.88,60.62 C20.C | 45.75,58.62 45.75,53.25 46.5,52.5 48.5,52.5 50.12,54.12 50.12,58.88
  Top 0.406: 51.05,15.88 51.58,16.4 JP3.2 51.53,20.65 | 51.05,15.88 51.09,15.83 U$1.P$2 | 51.05,15.88 53.59,15.88 54.5,14.96 54.5,11.26 | PWR2.C 38.98,5.71 39.62,5.08 39.62,4.13 C11.- | S1.P$3 13.12,6.75 13.12,2.38 JP5.8 | R19.1 41.59,29.09 43.75,31.25 49.75,31.25 53.75,35.25 53.71,35.29 U$5.GND@1 | 45.5,39.5 46.8,40.8 JP6.3 49.2,40.8 49.12,40.88 49.25,41 49.25,45.88 50.45,47.07 U$7.GND@2 53.43,47.07 53.38,47.12 | 45.54,36.34 45.62,36.25 | 45.54,36.34 C9.2 | 45.5,39.5 45.5,36.38 45.54,36.34 | 53.62,25.5 U$5.GND@2 53.62,25.12 51.62,23.12 51.62,20.75 51.53,20.65 | 51.53,20.65 51.38,20.5 | 53.38,47.12 58.09,51.84 U$7.GND@3 58.25,51.91 | U$5.GND@3 58.12,37 56.25,38.88 56.25,44.38 53.38,47.12 | 45.5,39.5 40.38,39.5 39.6,38.73 C19.C 39.6,35.35 39.12,34.88 39.12,33.38 39.2,33.3 | 39.2,33.3 39.25,33.25 | 39.2,33.3 C18.2 | 54.5,11.26 54.5,11.25 | U$1.P$3 54.5,11.26 | 58.25,51.91 58.25,51.88 | D2.A 50.12,58.88 51.75,58.88 53.62,57 | 53.62,57 53.62,57.03 U$7.GND@1 53.59,57.03 53.62,57 | JP4.1 32.14,61.62 30.88,62.75 6.88,62.75 6.38,62.25 6.38,61 4.38,59 1.88,59 1,58.12 1,44.75 1.5,44.25 3.35,44.25 | 3.35,44.25 3.5,44.25 | 3.35,44.25 JP2.6 | 58.25,51.91 58.25,52.38 53.62,57
  Bottom 0.305: v23,56.88 21.5,56.88 18.5,53.88 | v26,43.12 26,46.38 18.5,53.88 | 18.5,53.88 v17.5,53.88
  Bottom 0.406: 20.79,2.44 20.89,2.54 20.89,4.76 21.52,5.4 36.76,5.4 38.06,4.1 C11.- 39.62,4.11 | 20.79,2.44 JP5.5 | 18.13,2.44 18.15,2.42 JP5.6 JP5.7 | 18.13,2.44 20.79,2.44 | 18.13,2.44 18.03,2.54 | JP5.7 15.61,2.42 15.49,2.54 | JP5.8 13.07,2.42 | 13.07,2.42 JP5.7 | 13.07,2.42 12.95,2.54 | 53.59,35.29 53.5,35.38 | 53.59,35.29 U$5.GND@1 | 53.59,35.29 58.12,30.75 U$5.GND@3 58.12,30 53.41,25.29 | 53.41,25.29 53.38,25.25 | U$5.GND@2 53.41,25.29 | U$1.P$3 54.25,11.39 54.25,2.5 53.38,1.62 40.5,1.62 39.62,2.5 39.62,4.11 | 39.62,4.11 39.62,4.25 | U$7.GND@1 53.59,61.41 51.25,63.5 41.75,63.5 41.38,63.75 33.75,63.75 33.38,63.38 33.38,62.12 33.5,62
  other vias: 45.38,40.88 39.12,40.62 37.12,46.25 42,58.75
  pour Top (isolate 0.305): -0.88,66 62.12,66.12 62.12,65.87 62,-2.88 -0.62,-2.88 -0.88,-2.62
  pour Bottom (isolate 0.305): -3.45,66.82 62,66.5 62,66.25 62,-1.75 -2.25,-1.75 -2.5,-1.5
GS  (via drill 0.6)
  Top 0.254: R23.1 16.12,45.94 v16.12,43.62 | v18.62,20.38 20.5,18.5 IC1.55
  Bottom 0.254: v16.12,43.62 18.62,41.12 18.62,25.62 19,25.25 19,23.75 18.62,23.38 v18.62,20.38
HSYNC  (via drill 0.6)
  Top 0.254: IC1.13 28.75,24.75 31.12,27.12 31.12,32.88 32.75,34.5 v36.12,34.5 | U$2.16 36.6,58.1 36.62,58.12 34.75,58.12 34.62,58 v33.38,58
  Bottom 0.254: v36.12,34.5 34.25,36.38 34.25,52.88 32.5,54.62 32.5,57.12 v33.38,58
LED0
  Top 0.254: IC1.17 25,30.38 26.12,31.5 26.12,32.5 27.25,33.62 27.25,34.62 27.62,35 28.44,35 | 28.44,35 28.5,35 | 28.44,35 R10.1
N$1
  Top 0.305: C9.1 47.95,36.42 48.5,35.88 48.5,34.75 | 48.5,34.75 48.5,33.75 48.12,33.38 47.12,33.38 R7.2 | C8.1 48.57,34.68 48.5,34.75
N$2
  Top 0.254: IC1.62 24,13.12 25.38,11.75 25.38,7.75 Q1.2
  Top 0.305: Q1.2 25.65,7.62 28.51,7.62 28.82,7.94 C7.1
N$3
  Top 0.254: IC1.61 23.5,13.12 20.62,10.25 20.62,7.75 Q1.1
  Top 0.305: Q1.1 20.25,7.62 18.98,7.62 18.35,6.99 16.12,6.99 C6.1
N$4
  Top 0.254: R10.2 30.12,36.12 30.38,36.38 30.38,37.25 30.39,37.25 PWR1.C
N$5
  Top 0.305: U$2.10 39.89,50.48 40.12,50.25 40.12,48.75 40.25,48.62 40.38,48.75 C10.+
N$6
  Top 0.254: IC1.22 22.5,30.75 24,32.25 24,35.25 22.75,36.5 10,36.5 6.38,40.12 3.12,40.12 3.04,40.21 | 3.04,40.21 3,40.25 | JP1.1 3.04,40.21
N$7
  Top 0.305: JP6.2 51.78,38.41 51.38,38 50.12,38 49.62,37.5 49.62,36.25 49.56,36.19 | 49.56,36.19 49.5,36.12 | C8.2 49.56,36.19
N$8
  Top 0.305: C12.2 24.02,54.61 24.62,54 24.62,52.5 25.38,51.75 26.75,51.75 U$2.6
N$9
  Top 0.254: IC1.26 20.5,30.38 18.25,32.62 9,32.62 5.88,35.75 5.88,37.12 5.38,37.62 3.5,37.62 3.38,37.5 3.25,37.63 JP1.2
N$10
  Top 0.254: IC1.27 20,30.12 18.12,32 8.38,32 5.38,35 3.25,35 3.25,35.01 JP1.3
N$11
  Top 0.406: IC3.1 37.7,26.66 37.56,26.51 | 37.56,26.51 37.4,26.35 35.81,26.35 35.97,26.2 R18.1 | 37.56,26.51 | R19.2 37.4,26.67 37.56,26.51
N$12
  Top 0.254: IC1.29 19,30.38 18,31.38 6.5,31.38 5.38,32.5 3.5,32.5 3.41,32.59 JP1.4
N$13
  Top 0.254: IC1.30 18.5,30.12 17.75,30.88 14.12,30.88 13.25,30 3.88,30 3.38,29.5 3.38,29.75 2.75,30.38 2.88,30.38 3.2,30.05 JP1.5
N$14
  Top 0.305: C13.2 23.68,52.07 25.25,50.5 26.75,50.5 26.77,50.48 U$2.7
N$15
  Top 0.254: IC1.33 13.75,26.25 12.88,27.12 6,27.12 5.62,26.75 5.62,25.38 5.25,25 3.38,25 3.35,24.97 JP1.7
N$16
  Top 0.254: IC1.34 13.25,25.75 12.38,26.62 6.38,26.62 6.12,26.38 6.12,23.12 5.5,22.5 3.12,22.5 | 3.12,22.5 3.19,22.43 JP1.8 | 3.12,22.5 3,22.62
N$17
  Top 0.254: IC1.35 12.88,25.25 12.12,26 7.12,26 6.75,25.62 6.75,20.75 5.88,19.88 2.75,19.88 2.77,19.89 JP1.9
N$18
  Top 0.254: IC1.37 8.12,24.25 7.38,23.5 7.38,18.38 6.25,17.25 3.12,17.25 3.23,17.35 JP1.10
N$19
  Top 0.254: IC1.38 8.5,23.75 7.88,23.12 7.88,15.25 7.5,14.88 3.12,14.88 3.06,14.81 | 3.06,14.81 3,14.75 | JP1.11 3.06,14.81
N$20
  Top 0.254: IC1.39 9.25,23.25 8.5,22.5 8.5,15 6.62,13.12 6.12,13.12 5.38,12.38 3.25,12.38
  Top 0.305: 3.25,12.38 JP1.12
N$21
  Top 0.254: IC1.45 13.38,20.25 11,17.88 11,16.38 7.25,12.62 6.5,12.62 5.38,11.5 5.38,10 5.12,9.75 3.26,9.75
  Top 0.305: JP1.13 3.26,9.75
N$22
  Top 0.254: IC1.46 14.25,19.75 11.62,17.12 11.62,15.88 7.75,12 6.75,12 5.88,11.12 5.88,7.62 5.38,7.12 3.31,7.12 JP1.14
N$23  (via drill 0.6)
  Top 0.254: v19,14.38 19.5,15 IC1.53
  Bottom 0.254: JP1.15 3.27,4.62 5.12,4.62 6.88,6.38 6.88,10.38 10.88,14.38 v19,14.38
N$24
  Top 0.305: U$2.12 39.65,53.02 40.25,53.62 40.25,54.38 40.75,54.88 42.62,54.88 42.57,54.93 U$3.P$2
N$25  (via drill 0.6)
  Top 0.254: v20,13.5 IC1.54
  Bottom 0.254: JP1.16 3.26,2.12 5.38,2.12 5.62,2.38 5.62,4.12 7.75,6.25 7.75,10.12 11.12,13.5 v20,13.5
N$26
  Top 0.305: C14.2 24.59,49.53 24.88,49.25 26.62,49.25 26.66,49.21 U$2.8
N$27
  Top 0.305: R3.1 R2.1 13.8,58.42 | 13.8,58.42 13.75,58.38 | 13.76,56.13 13.75,56.12 | R1.1 13.76,56.13 | 13.8,58.42 13.8,56.17 13.76,56.13 | R4.2 15.91,58.41 15.88,58.38 15.82,58.42 13.8,58.42
N$28
  Top 0.305: U$7.SIG 53.55,52.07 53.38,52.25 49.6,52.25 49.44,52.06 49.42,52.04 R29.1
N$29
  Top 0.305: R11.1 13.93,48.58 14,48.5 | R11.1 R12.1 | R6.1 R11.1 | R11.1 13.93,48.67 14,48.75 | R13.2 16.12,48.63 16.12,48.62 R11.1
N$30
  Top 0.305: PWR2.A 32.32,5.08 32.32,4.45 32.63,4.13 33.91,4.13 34.22,3.81 34.22,2.54 R26.1
N$31
  Top 0.305: R21.2 27.56,44.81 28,45.25 28,46.12 28.38,46.5 29.38,46.5 29.3,46.58 R16.1 29.05,46.58 | 29.05,46.58 R15.1 | 29.05,46.58 29,46.62
N$32
  Top 0.305: 33.27,14.29 R28.2 R27.1
  Top 0.406: IC2.1 34.95,15.01 34.86,14.92 34.86,14.29 34.54,13.97 33.27,13.97 R28.2
N$33
  Top 0.305: U$3.P$1 47.27,57.52 47.62,57.88 47.62,58.62 47.12,59.12 47.18,59.18 C16.2 47.57,59.18 | 47.57,59.18 47.62,59.12 | C17.1 47.45,59.3 47.57,59.18
N$34
  Top 0.305: R17.1 44.49,61.49 44.62,61.62 45.88,61.62 45.84,61.59 C17.2 45.76,62.88 46.25,63.38 50,63.38 50.12,63.25 50.12,61.75 D2.C
N$35  (via drill 0.6)
  Top 0.305: U$2.1 28.85,58.1 v30.5,59.75 | JP4.2 36.01,63.38 36.38,63.75 40.12,63.75 40.62,63.25 40.62,62 41.12,61.5 R17.2
  Bottom 0.305: v30.5,59.75 35.62,59.75 36,60.12 36,61.5
  Bottom 0.406: JP4.2 36.01,62.01 36,62 36,61.5
N$36
  Top 0.305: C10.- 49.12,48.75 49.38,49 49.38,49.75 49.42,49.7 R29.2
R
  Top 0.305: R4.1 17.61,58.52 17.75,58.38 | R4.1 R20.2 | 17.61,55.77 17.59,55.78 R5.2 18.75,55.99 20.12,54.62 20.88,54.62 20.89,54.61 C12.1 | 17.61,55.77 R4.1 | 17.61,55.77 17.75,55.62
R0  (via drill 0.6)
  Top 0.254: IC1.16 28.25,26.25 29.12,27.12 29.12,29.12 27.12,31.12 v27.12,32 | R1.2 12,56.12 12,54.88 v13.75,53.12
  Bottom 0.254: v27.12,32 27.12,35.5 13.75,48.88 v13.75,53.12
R1  (via drill 0.6)
  Top 0.254: IC1.4 v29,20.25 | R2.2 12.02,58.62 10.88,58.62 v10.62,58.38
  Bottom 0.254: v29,20.25 29,34.62 14.62,49 14.62,52.12 15,52.5 15,53.5 10.62,57.88 v10.62,58.38
R2  (via drill 0.6)
  Top 0.254: IC1.40 17.25,22.75 17.88,23.38 v17.88,24.5 | R3.2 12.12,60.98 12.12,61 v10.88,61
  Bottom 0.254: v17.88,24.5 17.88,25.5 11.62,31.75 11.62,51.88 9.38,54.25 9.38,59.88 10.5,61 v10.88,61
RAW
  Top 0.406: U$1.P$1 48.02,7.79 48.83,6.99 51.69,6.99 | 51.69,6.99 53.27,5.4 53.27,3.17 53.25,4 53,2.88 D1.1 | JP3.1 54.12,17.57 57.72,13.97 57.72,7.62 57.08,6.99 51.69,6.99
RS  (via drill 0.6)
  Top 0.254: IC1.2 28.5,19.25 29.5,18.25 v30.62,18.25 | v20.12,61.5 19.38,61.5 18.88,62 16.25,62 16,61.75 16,61.12 16.12,61 16.09,60.96 R20.1
  Bottom 0.254: v30.62,18.25 30.62,22.25 35.5,27.12 35.5,32.38 32.75,35.12 32.75,49.75 30,52.5 30,54.38 22.88,61.5 v20.12,61.5
RST  (via drill 0.6)
  Top 0.254: v20.12,20.12 21.5,18.75 IC1.57 21.5,13.38 v20.38,12.25 | v11.62,53.5 11.5,53.62 9.38,53.62 8.75,53 8.75,50.5 8.5,50.25 7.57,50.25 R9.1 7.15,50.38 5.75,50.38 5.25,50.88 5.25,53.88 4.88,54.25 3.38,54.25 3.38,54.27 JP2.2 | S1.P$4 13.12,10.73 13.12,11.88 13.25,12 v13.25,12.25
  Top 0.305: 13.17,10.67 S1.P$4 | S1.P$1 13.17,10.67 | 13.17,10.67 13.25,10.75
  Bottom 0.254: v20.12,20.12 19.88,20.38 19.88,41.5 12.75,48.62 12.75,52.38 v11.62,53.5 | v13.25,12.25 14,13 18.12,13 18.88,12.25 v20.38,12.25
RXD0
  Top 0.254: IC1.21 23,30.38 24.5,31.88 24.5,35.5 22.62,37.38 10,37.38 5.62,41.75 5.62,45.88 4.88,46.62 3.25,46.62 3.25,46.69 JP2.5
SOUND
  Top 0.305: JP6.1 54.33,38.55 56.88,36 56.88,33.75 53.5,30.38 53.59,30.29 U$5.SIG
TXD0
  Top 0.254: IC1.19 24,30.38 25,31.38 25,36.12 22.88,38.25 10.5,38.25 6.5,42.25 6.5,48.25 5.62,49.12 3.38,49.12 3.25,49.25 3.27,49.27 JP2.4
VCC  (via drill 0.6)
  Top 0.254: IC1.63 24.5,14.38 25.25,13.62 26.62,13.62 v26.6,13.65 | IC1.7 29.25,21.75 29.62,22.12 32.45,22.12 v32.54,22.04 | 17,13 17.5,13.5 IC1.49 17.5,19.12 | C4.1 16.25,11.74 16.25,13 | 17.5,19.12 17.5,20.75 17,21.25 IC1.43 12.88,21.25 12,20.38 10.25,20.38 10.27,20.4 C1.1 | 17.5,19.12 18.12,19.12 18.5,18.75 IC1.51 18.5,16.88 | IC1.23 22,31.75 22.75,32.5 22.75,33.62
  Top 0.305: R27.2 32.95,10.79 | C2.1 26.6,12.06 v26.6,13.65 | 23.21,2.54 23.38,2.71 23.38,4.25 23,4.62 17,4.62 16.5,5.12 v16.5,5.25 | v14.75,11.88 15.88,13 16.25,13 17,13 | v8.12,35.88 9.38,34.62 22.38,34.62 | C3.1 22.74,33.63 22.75,33.62 23,33.62 23,34.37 22.75,34.62 22.38,34.62 | v25.88,35.5 26.5,36.12 28.25,36.12 28.88,36.75 28.88,38.25 29.5,38.88 33.5,38.88 33.99,38.38 PWR1.A 34,37.38 v35.75,37.38 | v22.38,35.5 22.38,34.62 | C5.1 34.25,22 32.58,22 v32.54,22.04 | 6.88,55.75 6.88,56.5 6.38,57 3.38,57 3.38,56.97 JP2.1 | R9.2 7.75,52.13 7.75,52.75 8.12,53.12 8.12,55.38 7.75,55.75 6.88,55.75 | 6.88,55.75 6.88,55.71 R8.1
  Top 0.406: 36.13,1.2 33.08,1.2 32.63,1.65 32.63,2.22 32.32,2.54 31.05,2.54 30.95,2.44 | 36.13,1.2 40.89,1.2 41.52,1.84 41.52,6.67 39.62,8.57 39.62,12.06 38.98,12.7 | 30.95,2.44 JP5.1 | R26.2 36.13,2.44 36.13,1.2 | 30.95,2.44 30.85,2.54 28.51,2.54 28.51,2.52 JP5.2 28.29,2.54 25.75,2.54 | 25.75,2.54 25.65,2.54 25.61,2.5 23.25,2.5 JP5.4 23.21,2.54 23.11,2.54 | 25.75,2.54 JP5.3 | 38.98,12.7 IC2.2 34.86,12.7 34.54,12.38 34.54,11.11 34.22,10.79 33.27,10.79 R27.2 | C15.A 41.37,17.62 41.21,17.46 39.94,17.46 39.3,16.83 39.3,13.02 38.98,12.7 | 32.95,10.79 31.68,10.79 v31.05,11.43 | JP2.1 3.19,57
  Bottom 0.305: v16.5,5.25 14.38,7.38 14.38,11.38 v14.75,11.88 | JP2.1 6.86,56.89 8.12,55.62 v8.12,35.88 | 32.54,21.91 v32.54,22.04 37.25,26.75 37.25,35.88 v35.75,37.38 | 26.12,35.5 v25.88,35.5 v22.38,35.5
  Bottom 0.406: v31.05,11.43 32.54,12.81 32.54,13.65 | 32.54,13.65 32.54,21.91 | 32.54,13.65 v26.6,13.65
VIN  (via drill 0.6)
  Top 0.406: C11.+ 43.14,4.1 43.11,4.13 45.97,4.13 46.83,3.27 48.75,3.25 D1.2 | IC3.3 39.11,22.03 38.98,21.91 v42.48,21.91
  Bottom 0.406: C11.+ 43.17,21.22 v42.48,21.91
VSYNC  (via drill 0.6)
  Top 0.254: IC1.14 28.12,25.25 30.25,27.38 30.25,33.38 32.38,35.5 35.88,35.5 37,36.62 37,41.62 37.69,42.31 38.12,42.75 42.62,42.75 43.12,43.25 43.12,44.46 | 43.12,44.46 43,44.5 | 43.12,44.46 R25.2
  Top 0.305: U$2.15 34.08,56.83 v34,56.75 | 37.69,42.31 v36.25,43.75
  Bottom 0.305: v34,56.75 34,54.25 35,53.25 35,45 v36.25,43.75
(copper drawn outside any net)
  shapes: Top area x2

### Text on the board
tPlace: www.critterandguitari.com | Video | 0.2 | Critter | 0.3 | 0.4 | Hi-Res | 0.5 | stat | 0.6 | 0.7 | 0.8 | 0.9 | 0.10 | GND | Vin | 0.11 | 0.12 | 0.13 | v01 | RST | 0.15 | 0.16 | 0.18 | Vcc | 9VDC | GND | pwr | 0.19